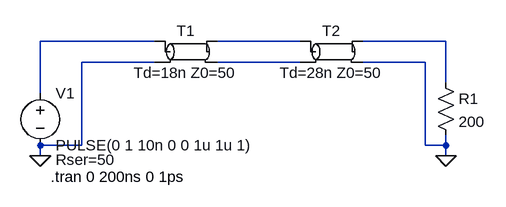
[diagram p0: schematic p1.asc]
p1.asc, the LTspice schematic file:
Version 4
SHEET 1 880 680
WIRE 208 224 32 224
WIRE 432 224 304 224
WIRE 656 224 528 224
WIRE 208 256 96 256
WIRE 432 256 304 256
WIRE 624 256 528 256
WIRE 656 288 656 224
WIRE 32 304 32 224
WIRE 96 384 96 256
WIRE 96 384 32 384
WIRE 624 384 624 256
WIRE 656 384 656 368
WIRE 656 384 624 384
WIRE 32 400 32 384
WIRE 656 400 656 384
FLAG 32 400 0
FLAG 656 400 0
SYMBOL tline 256 240 R0
SYMATTR InstName T1
SYMATTR Value Td=18n Z0=50
SYMBOL tline 480 240 R0
SYMATTR InstName T2
SYMATTR Value Td=28n Z0=50
SYMBOL Voltage 32 288 R0
WINDOW 39 24 118 Left 2
SYMATTR SpiceLine Rser=50
SYMATTR InstName V1
SYMATTR Value PULSE(0 1 10n 0 0 1u 1u 1)
SYMBOL Res 640 272 R0
SYMATTR InstName R1
SYMATTR Value 200
TEXT 48 432 Left 2 !.tran 0 200ns 0 1ps

The netlist it stands for:
* p1.asc
T1 N001 0 N002 N004 Td=18n Z0=50
T2 N002 N004 N003 0 Td=28n Z0=50
V1 N001 0 PULSE(0 1 10n 0 0 1u 1u 1) Rser=50
R1 N003 0 200
.tran 0 200ns 0 1ps
.backanno
.end